# EasyEDA Pro project 轮腿PCB.eprj, board PCB2
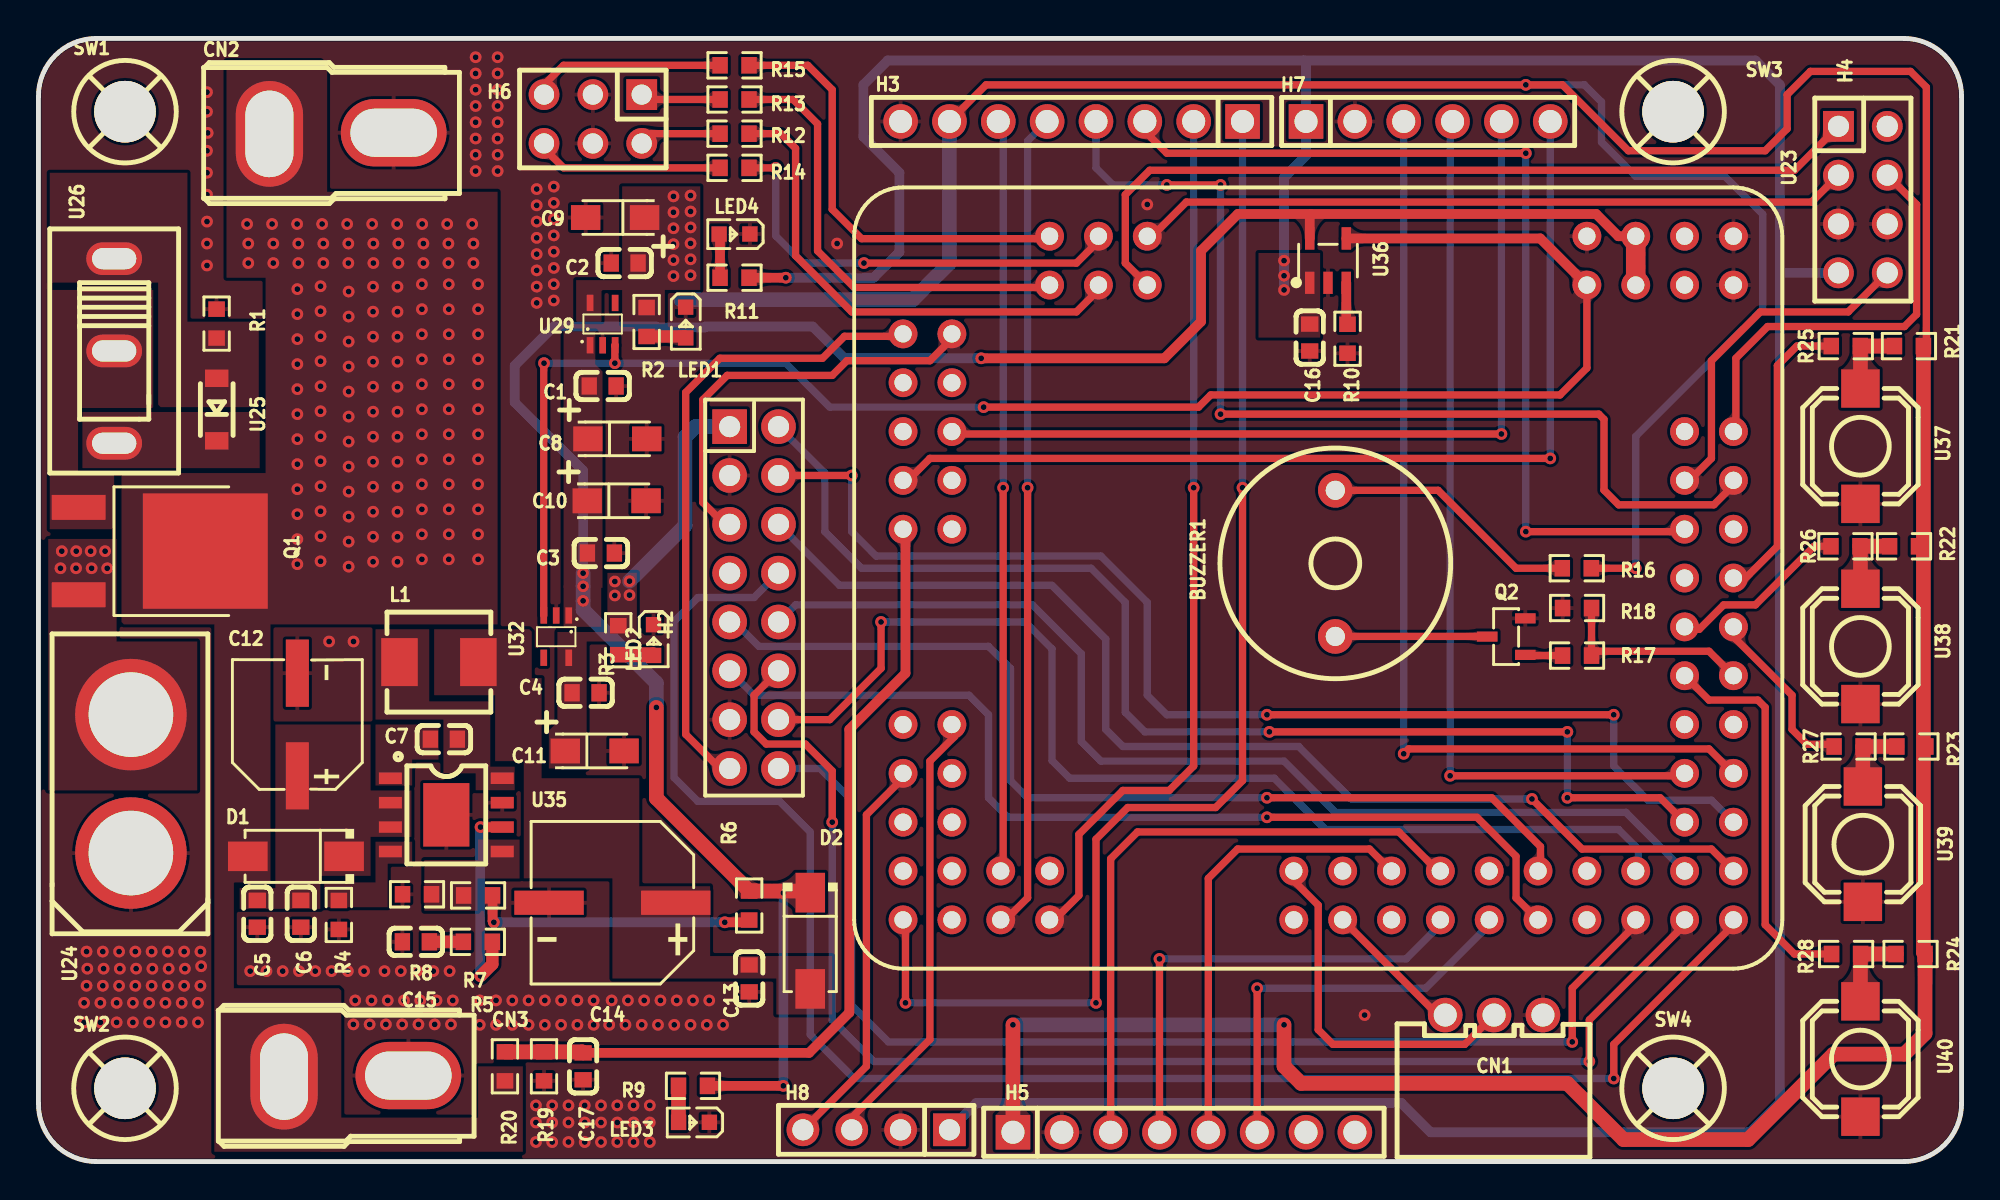
[diagram p8: board, top side]
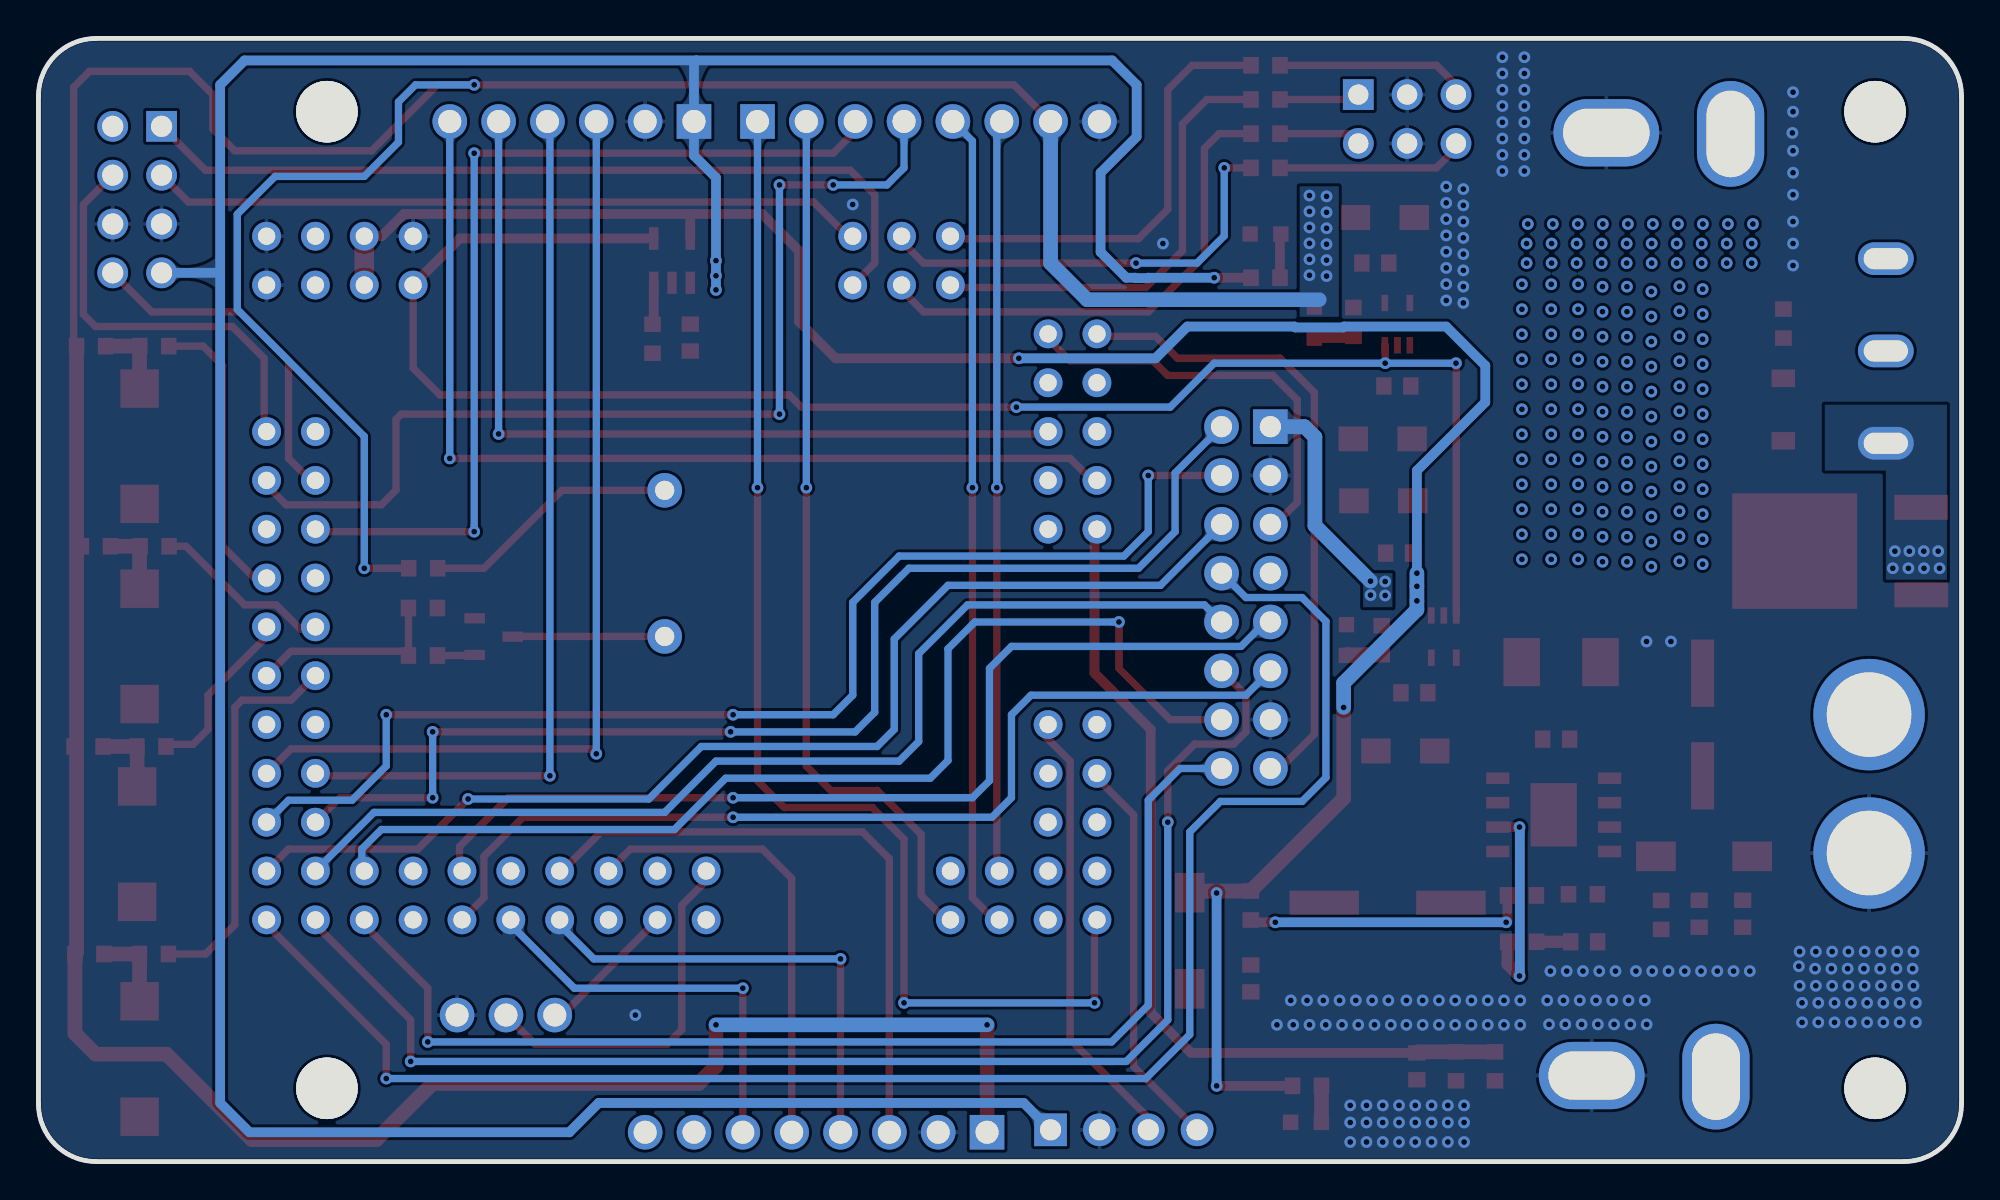
[diagram p9: board, bottom side, seen from below]

Outline 100 x 58.42 mm; copper layers: Top Layer, Bottom Layer. Coordinates in mm from the lower left corner of the outline.
Outline path: 0,55.42 0,3 arc(0.88,0.88) 3,0 97,0 arc(99.12,0.88) 100,3 100,55.42 arc(99.12,57.54) 97,58.42 3,58.42 arc(0.88,57.54) 0,55.42
Stack: Top Layer 0.035mm / Dielectric1 1.51mm FR4 er 4.5 / Bottom Layer 0.035mm

## Design rules (mm)
template: JLCPCB Capability(Two Layers Board)
spacing copperThickness1oz (default): track to track 0.102, other pairs 0.152 to 0.3
spacing copperThickness2oz: track to track 0.203, other pairs 0.152 to 0.3
track width copperThickness1oz (default): min 0.127, default 0.254, max 2.54
track width copperThickness2oz: min 0.203, default 0.254, max 2.54
differential pair differentialPair (default): width min 0.127, default 0.254, max 2.54; gap min 0.152, default 0.152
via viaSize (default): diameter min 0.5, default 0.61, max 10; hole min 0.3, default 0.305, max 6.3

## Placement (name value [footprint] x y rotation side)
BUZZER1  2.4kHz  [BUZ-TH_BD12.0-P7.60-D0.6-FD]  67.44 31.11 270 top
C1  100nF  [C0603]  29.34 40.34 180 top
C2  100nF  [C0603]  30.48 46.74 0 top
C3  100nF  [C0603]  29.25 31.65 180 top
C4  100nF  [C0603]  28.45 24.38 180 top
C5  4.7uf  [C0603]  11.38 12.89 90 top
C6  100nF  [C0603]  13.64 12.89 90 top
C7  100nF  [C0603]  21.08 21.97 0 top
C8  10uF  [CAP-SMD_L3.2-W1.6-RD-C7171]  30.1 37.59 0 top
C9  10uF  [CAP-SMD_L3.2-W1.6-RD-C7171]  29.99 49.1 180 top
C10  10uF  [CAP-SMD_L3.2-W1.6-RD-C7171]  30.06 34.37 0 top
C11  10uF  [CAP-SMD_L3.2-W1.6-RD-C7171]  28.92 21.36 0 top
C12  100uF  [CAP-SMD_BD6.3-L6.6-W6.6-LS7.3-FD-H7.7]  13.46 22.73 90 top
C13  47uf  [C0603]  36.96 9.52 90 top
C14  220uF  [CAP-SMD_BD8.0-L8.3-W8.3-LS9.1-FD]  29.84 13.46 180 top
C15  4.7nF  [C0603]  19.62 11.43 0 top
C16  100nF  [C0603]  66.1 42.86 90 top
C17  100nF  [C0603]  28.32 4.95 90 top
CN1  XH-3AW  [CONN-TH_3P-P2.54_HCTL_XH-3AW]  75.69 7.62 180 top
CN2  AM-1015B-M  [CONN-TH_AM-1015B-M]  15.24 53.49 0 top
CN3  AM-1015B-M  [CONN-TH_AM-1015B-M]  16 4.44 0 top
D1  SS54  [SMA_L4.4-W2.8-LS5.4-R-RD]  13.39 15.87 180 top
D2  SS54  [SMA_L4.4-W2.8-LS5.4-R-RD]  40.13 11.48 270 top
H2  -  [HDR-TH_16P-P2.54-V-F-R2-C8-S2.54-1]  37.21 29.34 270 top
H3  -  [HDR-TH_8P-P2.54-V-F-1]  53.72 54.1 180 top
H4  -  [HDR-TH_8P-P2.54-V-F-R2-C4-S2.54-1]  94.87 50.04 270 top
H5  -  [HDR-TH_8P-P2.54-V-F-1]  59.56 1.52 0 top
H6  -  [HDR-TH_6P-P2.54-V-R2-C3-S2.54_A2541WV-2X3P]  28.83 54.23 180 top
H7  -  [HDR-TH_6P-P2.54-V-M-1]  72.26 54.1 0 top
H8  -  [HDR-TH_4P-P2.54-V-M]  43.56 1.65 180 top
L1  4.7uH  [IND-SMD_L5.4-W5.2_FXL0530]  20.82 25.98 0 top
LED1  -  [LED_0603]  33.66 43.59 270 top
LED2  -  [LED_0603]  31.99 27.08 270 top
LED3  -  [LED_0603]  34.04 2.03 180 top
LED4  -  [LED_0603]  36.14 48.24 180 top
Q1  HY19P03D  [TO-252-2_L6.6-W6.1-P4.57-LS9.9-TL-CW]  5.38 31.76 0 top
Q2  S8050  [SOT-23-3_L2.9-W1.3-P1.90-LS2.3-BR]  76.33 27.3 0 top
R1  10K  [R0603]  9.26 43.59 270 top
R2  2.7K  [R0603]  31.62 43.67 270 top
R3  2.7K  [R0603]  30.15 27.12 270 top
R4  200K  [R0603]  15.62 12.83 90 top
R5  20K  [R0603]  22.85 11.43 0 top
R6  51K  [R0603]  36.96 13.32 90 top
R7  1.5K  [R0603]  22.86 13.84 0 top
R8  10K  [R0603]  19.69 13.9 0 top
R9  4.7K  [R0603]  34.04 3.94 0 top
R10  4.7K  [R0603]  68.07 42.8 90 top
R11  4.7K  [R0603]  36.19 45.97 0 top
R12  100R  [R0603]  36.19 53.47 180 top
R13  100R  [R0603]  36.19 55.24 180 top
R14  100R  [R0603]  36.19 51.69 0 top
R15  100R  [R0603]  36.19 57.02 0 top
R16  10R  [R0603]  79.99 30.86 180 top
R17  4.7K  [R0603]  80.01 26.32 180 top
R18  1K  [R0603]  80.01 28.79 180 top
R19  20K  [R0603]  26.29 4.95 90 top
R20  200K  [R0603]  24.26 4.95 270 top
R21  4.7K  [R0603]  97.26 42.42 180 top
R22  4.7K  [R0603]  97.01 32 180 top
R23  4.7K  [R0603]  97.39 21.59 180 top
R24  4.7K  [R0603]  97.35 10.79 180 top
R25  470R  [R0603]  93.98 42.42 180 top
R26  470R  [R0603]  93.96 32 180 top
R27  470R  [R0603]  94.12 21.59 180 top
R28  470R  [R0603]  94 10.79 180 top
SW1  -  [M3螺丝]  4.5 54.61 0 top
SW2  -  [M3螺丝]  4.5 3.81 0 top
SW3  -  [M3螺丝]  85 54.61 0 top
SW4  -  [M3螺丝]  85 3.81 0 top
U23  CYT4BB7CEx_CoreBoard  [CYT4BB7CEx_CoreBoard_V1.x]  62.74 30.35 270 top
U24  XT60-M.  [CONN-TH_XT60]  4.81 19.65 90 top
U25  BZT52C16-E3-08  [SOD-123_L2.7-W1.6-LS3.7-R-RD]  9.27 39.12 90 top
U26  HX SS12D10G4  [SW-TH_SHOU-HAN_SS12D10G4]  3.94 42.16 270 top
U29  RT9013-33GU5  [SC-70-5_L2.0-W1.3-P0.65-LS2.1-BR]  29.34 43.56 270 top
U32  RT9013-33GU5  [SC-70-5_L2.0-W1.3-P0.65-LS2.1-BR]  26.92 27.3 90 top
U35  SCT2450CQSTER  [ESOP-8_L4.9-W3.9-P1.27-LS6.0-BL-EP]  21.21 18.03 270 top
U36  SY6280AAC  [SOT-23-5_L3.0-W1.7-P0.95-LS2.8-BL]  67.06 46.86 0 top
U37  TS6643WS 250gf 072  [SW-SMD_L6.0-W6.0-P6.00-LS6.8]  94.74 37.21 270 top
U38  TS6643WS 250gf 072  [SW-SMD_L6.0-W6.0-P6.00-LS6.8]  94.74 26.8 270 top
U39  TS6643WS 250gf 072  [SW-SMD_L6.0-W6.0-P6.00-LS6.8]  94.87 16.51 270 top
U40  TS6643WS 250gf 072  [SW-SMD_L6.0-W6.0-P6.00-LS6.8]  94.74 5.33 270 top

## Footprints (pads in the part's own frame, mm; a bottom-side part is the same pattern mirrored in y, then rotated)
BUZ-TH_BD12.0-P7.60-D0.6-FD
  round 1.8 hole 1: 1(-3.8,0) 2(3.8,0)
C0603
  rect 0.8x0.9 smd: 1(-0.7,0) 2(0.7,0)
CAP-SMD_BD6.3-L6.6-W6.6-LS7.3-FD-H7.7
  rect 3.5x1.2 smd: 1(-2.67,0) 2(2.67,0)
CAP-SMD_BD8.0-L8.3-W8.3-LS9.1-FD
  rect 3.61x1.26 smd: 1(-3.295,0) 2(3.295,0)
CAP-SMD_L3.2-W1.6-RD-C7171
  rect 1.53x1.296 smd: 1(-1.53,0) 2(1.53,0)
CONN-TH_3P-P2.54_HCTL_XH-3AW
  round 1.8 hole 1.199: 1(-2.54,0) 2(0.002,0) 3(2.54,0)
CONN-TH_AM-1015B-M
  oval 3.5x5.5 hole 2.5x4.5: 1(-3.231,-0.029)
  oval 5.5x3.5 hole 4.5x2.5: 2(3.231,0.029)
CONN-TH_XT60
  round 5.8 hole 4.4: 1(-3.6,0) 2(3.6,0)
CYT4BB7CEx_CoreBoard_V1.x
  round 1.5 hole 0.9: 1(-17.78,25.4) 2(-15.24,25.4) 3(-17.78,22.86) 4(-15.24,22.86) 5(-17.78,20.32) 6(-15.24,20.32) 7(-17.78,17.78) 8(-15.24,17.78) 25(-17.78,-5.08) 26(-15.24,-5.08) 27(-17.78,-7.62) 28(-15.24,-7.62) 29(-17.78,-10.16) 30(-15.24,-10.16) 37(-12.7,-17.78) 38(-12.7,-15.24) 39(-10.16,-17.78) 40(-10.16,-15.24) 41(-7.62,-17.78) 42(-7.62,-15.24) 43(-5.08,-17.78) 44(-5.08,-15.24) 45(-2.54,-17.78) 46(-2.54,-15.24) 53(7.62,-17.78) 54(7.62,-15.24) 55(10.16,-17.78) 56(10.16,-15.24) 57(12.7,-17.78) 58(12.7,-15.24) 59(17.78,-17.78) 60(15.24,-17.78) 61(17.78,-15.24) 62(15.24,-15.24) 63(17.78,-12.7) 64(15.24,-12.7) 65(17.78,-10.16) 66(15.24,-10.16) 75(17.78,2.54) 76(15.24,2.54) 77(17.78,5.08) 78(15.24,5.08) 79(17.78,7.62) 80(15.24,7.62) 81(17.78,10.16) 82(15.24,10.16) 83(17.78,12.7) 84(15.24,12.7) 85(17.78,15.24) 86(15.24,15.24) 87(17.78,17.78) 88(15.24,17.78) 89(17.78,20.32) 90(15.24,20.32) 91(17.78,22.86) 92(15.24,22.86) 93(17.78,25.4) 94(15.24,25.4) 95(12.7,25.4) 96(12.7,22.86) 97(10.16,25.4) 98(10.16,22.86) 99(7.62,25.4) 100(7.62,22.86) 101(5.08,25.4) 102(5.08,22.86) 103(2.54,25.4) 104(2.54,22.86) 105(0,25.4) 106(0,22.86) 107(-2.54,25.4) 108(-2.54,22.86) 109(-5.08,25.4) 110(-5.08,22.86) 111(-7.62,25.4) 112(-7.62,22.86)
ESOP-8_L4.9-W3.9-P1.27-LS6.0-BL-EP
  rect 0.6x1.2 smd: 1(-1.905,-2.909) 2(-0.635,-2.909) 3(0.635,-2.909) 4(1.905,-2.909) 5(1.905,2.909) 6(0.635,2.909) 7(-0.635,2.909) 8(-1.905,2.909)
  rect 3.3x2.4 smd: 9(0,0)
HDR-TH_4P-P2.54-V-M
  rect 1.7x1.7 hole 1.1: 1(-3.81,0)
  round 1.7 hole 1.1: 2(-1.27,0) 3(1.27,0) 4(3.81,0)
HDR-TH_6P-P2.54-V-M-1
  rect 1.8x1.8 hole 1.2: 1(-6.35,0)
  round 1.8 hole 1.2: 2(-3.81,0) 3(-1.27,0) 4(1.27,0) 5(3.81,0) 6(6.35,0)
HDR-TH_6P-P2.54-V-R2-C3-S2.54_A2541WV-2X3P
  rect 1.6x1.6 hole 1.05: 1(-2.54,-1.27)
  round 1.6 hole 1.05: 2(-2.54,1.27) 3(0,-1.27) 4(0,1.27) 5(2.54,-1.27) 6(2.54,1.27)
HDR-TH_8P-P2.54-V-F-1
  rect 1.8x1.8 hole 1.2: 1(-8.89,0)
  round 1.8 hole 1.2: 2(-6.35,0) 3(-3.81,0) 4(-1.27,0) 5(1.27,0) 6(3.81,0) 7(6.35,0) 8(8.89,0)
HDR-TH_8P-P2.54-V-F-R2-C4-S2.54-1
  rect 1.6x1.6 hole 1.1: 1(-3.81,-1.27)
  round 1.6 hole 1.1: 2(-3.81,1.27) 3(-1.27,-1.27) 4(-1.27,1.27) 5(1.27,-1.27) 6(1.27,1.27) 7(3.81,-1.27) 8(3.81,1.27)
HDR-TH_16P-P2.54-V-F-R2-C8-S2.54-1
  rect 1.8x1.8 hole 1.1: 1(-8.89,-1.27)
  round 1.8 hole 1.1: 2(-8.89,1.27) 3(-6.35,-1.27) 4(-6.35,1.27) 5(-3.81,-1.27) 6(-3.81,1.27) 7(-1.27,-1.27) 8(-1.27,1.27) 9(1.27,-1.27) 10(1.27,1.27) 11(3.81,-1.27) 12(3.81,1.27) 13(6.35,-1.27) 14(6.35,1.27) 15(8.89,-1.27) 16(8.89,1.27)
IND-SMD_L5.4-W5.2_FXL0530
  rect 1.9x2.5 smd: 1(-2.05,0) 2(2.05,0)
LED_0603
  rect 0.8x0.8 smd: 1(-0.851,-0.01) 2(0.75,-0.005)
M3螺丝
  round 3.2 hole 3.2: 1(0,0)
R0603
  rect 0.806x0.864 smd: 1(-0.753,0) 2(0.753,0)
SC-70-5_L2.0-W1.3-P0.65-LS2.1-BR
  rect 0.85x0.35 smd: 1(1.1,-0.65) 2(1.1,0) 3(1.1,0.65) 4(-1.1,0.65) 5(-1.1,-0.65)
SMA_L4.4-W2.8-LS5.4-R-RD
  rect 2.062x1.539 smd: 1(2.503,0) 2(-2.503,0)
SOD-123_L2.7-W1.6-LS3.7-R-RD
  rect 0.909x1.219 smd: 1(1.625,0) 2(-1.625,0)
SOT-23-3_L2.9-W1.3-P1.90-LS2.3-BR
  rect 1.07x0.532 smd: 1(0.99,-0.95) 2(0.99,0.95) 3(-0.99,0)
SOT-23-5_L3.0-W1.7-P0.95-LS2.8-BL
  rect 0.49x1.157 smd: 1(-0.95,-1.153) 2(0,-1.153) 3(0.95,-1.153)
  rect 0.49x1.175 smd: 4(0.95,1.153) 5(-0.95,1.153)
SW-SMD_L6.0-W6.0-P6.00-LS6.8
  rect 2x2 smd: 1(-3,0) 2(3,0)
SW-TH_SHOU-HAN_SS12D10G4
  oval 1.7x2.9 hole 1.1x2.3: 1(-4.8,0) 2(0,0) 3(4.8,0)
TO-252-2_L6.6-W6.1-P4.57-LS9.9-TL-CW
  rect 2.8x1.3 smd: 1(-3.292,2.273) 3(-3.292,-2.273)
  rect 6.5x6 smd: 2(3.292,0)

## Nets
As in the schematic.

Pads without a net: H2 7; H4 2; H5 7 8; SW1 1; SW2 1; SW3 1; SW4 1; U23 3 4 39 40 41 44 46 53 56 57 58 60 61 62 66 75 78 79 84 87 88 99 100 106 107 112; U29 4; U32 4

## Via types
v1: diameter 0.61, hole 0.305, Top Layer to Bottom Layer, 373 vias

## Routing (per net, layer and track width the routed paths; a pad name or vN(x,y) marks a point on that pad's centre or on a via; arc(x,y) is an arc through that point)
GND:
  vias: v1(2.37,8.25) v1(2.37,7.24) v1(2.5,10.92) v1(2.54,10.03) v1(2.5,9.14) v1(3.22,8.25) v1(3.22,7.24) v1(3.35,10.92) v1(3.35,9.14) v1(3.39,10.03) v1(4.06,8.25) v1(4.06,7.24) v1(4.19,10.92) v1(4.23,10.03) v1(4.19,9.14) v1(4.91,8.25) v1(4.91,7.24) v1(5.04,10.92) v1(5.04,9.14) v1(5.08,10.03) v1(5.76,8.25) v1(5.76,7.24) v1(5.88,10.92) v1(5.92,10.03) v1(5.88,9.14) v1(6.6,8.25) v1(6.6,7.24) v1(6.73,10.92) v1(6.73,9.14) v1(6.77,10.03) v1(7.45,8.25) v1(7.45,7.24) v1(7.58,10.92) v1(7.62,10.03) v1(7.58,9.14) v1(8.29,8.25) v1(8.29,7.24) v1(8.42,10.92) v1(8.42,9.14) v1(8.46,10.16) v1(8.76,55.63) v1(8.76,54.61) v1(8.8,53.51) v1(8.76,52.58) v1(8.76,51.43) v1(8.76,50.29) v1(8.76,48.89) v1(8.76,47.75) v1(8.76,46.61) v1(11.01,9.91) v1(11.86,9.91) v1(12.7,9.91) v1(13.55,9.91) v1(14.39,9.91) v1(15.11,27.05) v1(15.24,9.91) v1(16.08,9.91) v1(16.38,27.05) v1(16.38,7.13) v1(16.47,8.38) v1(16.93,9.91) v1(17.22,7.13) v1(17.32,8.38) v1(17.99,9.91) v1(18.07,7.13) v1(18.16,8.38) v1(18.84,9.91) v1(18.91,7.13) v1(19.01,8.38) v1(19.69,9.91) v1(19.76,7.13) v1(19.85,8.38) v1(20.53,9.91) v1(20.6,7.13) v1(20.7,8.38) v1(21.38,9.91) v1(21.55,8.38) v1(21.45,7.13) v1(22.73,57.44) v1(22.73,56.6) v1(22.73,55.75) v1(22.73,54.91) v1(22.73,54.06) v1(22.73,53.21) v1(22.73,52.37) v1(22.73,51.52) v1(22.95,8.38) v1(22.95,7.11) v1(23.79,8.38) v1(23.79,7.11) v1(23.88,57.44) v1(23.88,56.6) v1(23.88,55.75) v1(23.88,54.91) v1(23.88,54.06) v1(23.88,53.21) v1(23.88,52.37) v1(23.88,51.52) v1(24.64,8.38) v1(24.64,7.11) v1(25.48,8.38) v1(25.48,7.11) v1(25.91,50.59) v1(25.91,49.74) v1(25.91,48.89) v1(25.91,48.05) v1(25.91,47.2) v1(25.91,46.36) v1(25.91,45.51) v1(25.91,44.66) v1(25.87,2.92) v1(25.87,2.03) v1(25.87,1.02) v1(26.33,8.38) v1(26.33,7.11) v1(26.71,2.92) v1(26.71,2.03) v1(26.71,1.02) v1(26.8,50.71) v1(26.8,49.87) v1(26.8,49.02) v1(26.8,48.17) v1(26.8,47.33) v1(26.8,46.48) v1(26.8,45.64) v1(26.8,44.79) v1(27.18,8.38) v1(27.18,7.11) v1(27.56,2.92) v1(27.56,2.03) v1(27.56,1.02) v1(28.02,8.38) v1(28.02,7.11) v1(28.41,2.92) v1(28.41,2.03) v1(28.41,1.02) v1(28.87,8.38) v1(28.87,7.11) v1(29.25,2.92) v1(29.25,2.03) v1(29.25,1.02) v1(29.68,7.11) v1(29.81,8.38) v1(30.1,2.92) v1(30.1,2.03) v1(30.1,1.02) v1(30.52,7.11) v1(30.65,8.38) v1(30.94,2.92) v1(30.94,2.03) v1(30.94,1.02) v1(31.37,7.11) v1(31.5,8.38) v1(31.79,2.92) v1(31.79,2.03) v1(31.79,1.02) v1(32.22,7.11) v1(32.34,8.38) v1(33.06,7.11) v1(33.19,8.38) v1(33.91,7.11) v1(34.03,8.38) v1(34.75,7.11) v1(34.88,8.38) v1(35.6,7.11) v1(41.53,47.75) v1(57.66,49.78) v1(68.96,7.62)
VCC3V3: length 226.4
  Top Layer w0.381: R21.1 98.17,42.57 98.17,55.88 97.35,56.71 92.14,56.71 90.93,55.5 90.93,53.72 89.79,52.58 82.68,52.58 79.25,56.01 v1(77.34,56.01) 49.28,56.01 H3.7 ; R16.1 v1(83.06,30.86)
  Top Layer w0.762: v1(64.77,7.11) 64.77,4.95 65.66,4.06 79.5,4.06 82.42,1.14 88.9,1.14 93.34,5.59 97.03,5.59 98.1,6.66 R24.1 98.02,10.88 R21.1 ; H5.1 v1(50.67,7.11)
  Bottom Layer w0.381: v1(77.34,56.01) 80.39,56.01 81.28,55.12 81.28,53.02 83.06,51.24 87.69,51.24 89.66,49.28 89.66,44.32 83.06,37.72 v1(83.06,30.86)
  Bottom Layer w0.762: v1(50.67,7.11) v1(64.77,7.11) ; 33.4,44.83 45.47,44.83 47.37,46.74 H3.7
  vias: v1(33.02,50.21) v1(33.02,49.38) v1(33.02,48.55) v1(33.02,47.72) v1(33.02,46.89) v1(33.02,46.06) v1(33.91,50.25) v1(33.91,49.42) v1(33.91,48.59) v1(33.91,47.76) v1(33.91,46.93) v1(33.91,46.1)
VCC5V: length 119
  Top Layer w0.508: 83.06,48.13 82.15,48.13 81,49.29 66.17,49.29 ; v1(49.02,41.78) 58.55,41.78 60.45,43.69 60.45,47.37 62.37,49.29 66.17,49.29 ; 66.17,49.29 66.11,49.23 U36.5 ; R9.2 v1(38.74,3.94)
  Top Layer w0.762: D2.2 40.05,14.07 R6.2 32.13,18.9 v1(32.13,23.62)
  Top Layer w1.016: U23.6 83.06,48.13
  Bottom Layer w0.508: v1(38.74,3.94) v1(38.74,13.97) ; v1(49.02,41.78) 41.91,41.78 40.26,43.43 34.69,43.43 34.65,43.39 32.16,43.39 32.11,43.43 26.8,43.43 24.77,41.4 24.77,39.5 28.32,35.94 v1(28.32,30.61)
  Bottom Layer w0.762: v1(32.13,23.62) 32.13,24.89 28.32,28.7 v1(28.32,29.17) v1(28.32,29.92) v1(28.32,30.61)
VCC5V_EXT: length 180.1
  Top Layer w0.508: R11.2 v1(38.86,45.97)
  Bottom Layer w0.508: H8.1 48.77,3.05 70.87,3.05 72.39,1.52 89.03,1.52 90.55,3.05 90.55,46.23 ; 65.79,57.28 89.28,57.28 90.55,56.01 90.55,46.23 ; 65.79,57.28 65.91,57.15 H7.1 65.91,52.32 64.77,51.18 v1(64.77,46.86) v1(64.77,46.07) v1(64.77,45.34) ; 65.79,57.28 44.16,57.28 42.89,56.01 42.89,53.31 44.77,51.43 44.77,47.31 43.43,45.97 42.97,45.97 42.95,45.95 42.32,45.95 42.3,45.97 v1(38.86,45.97) ; 90.55,46.23 H4.7
VCCBAT:
  vias: v1(10.85,48.77) v1(10.91,47.75) v1(10.91,46.74) v1(12.15,48.77) v1(12.21,47.75) v1(12.21,46.74) v1(13.45,48.77) v1(13.51,47.75) v1(13.51,46.74) v1(13.46,45.38) v1(13.46,44.08) v1(13.46,42.78) v1(13.46,41.48) v1(13.46,40.18) v1(13.46,38.88) v1(13.46,37.58) v1(13.46,36.28) v1(13.46,34.97) v1(13.46,33.67) v1(13.46,32.37) v1(13.46,31.07) v1(14.67,45.53) v1(14.67,44.23) v1(14.67,42.93) v1(14.67,41.63) v1(14.67,40.33) v1(14.67,39.03) v1(14.67,37.73) v1(14.67,36.43) v1(14.67,35.13) v1(14.67,33.82) v1(14.67,32.52) v1(14.67,31.22) v1(14.75,48.77) v1(14.81,47.75) v1(14.81,46.74) v1(16.05,48.77) v1(16.11,47.75) v1(16.11,46.74) v1(16.13,45.25) v1(16.13,43.95) v1(16.13,42.65) v1(16.13,41.35) v1(16.13,40.05) v1(16.13,38.75) v1(16.13,37.45) v1(16.13,36.15) v1(16.13,34.85) v1(16.13,33.55) v1(16.13,32.25) v1(16.13,30.95) v1(17.35,48.77) v1(17.41,47.75) v1(17.41,46.74) v1(17.4,45.51) v1(17.4,44.21) v1(17.4,42.91) v1(17.4,41.61) v1(17.4,40.3) v1(17.4,39) v1(17.4,37.7) v1(17.4,36.4) v1(17.4,35.1) v1(17.4,33.8) v1(17.4,32.5) v1(17.4,31.2) v1(18.65,48.77) v1(18.72,47.75) v1(18.72,46.74) v1(18.67,45.51) v1(18.67,44.21) v1(18.67,42.91) v1(18.67,41.61) v1(18.67,40.3) v1(18.67,39) v1(18.67,37.7) v1(18.67,36.4) v1(18.67,35.1) v1(18.67,33.8) v1(18.67,32.5) v1(18.67,31.2) v1(19.94,45.63) v1(19.94,44.33) v1(19.94,43.03) v1(19.94,41.73) v1(19.94,40.43) v1(19.94,39.13) v1(19.94,37.83) v1(19.94,36.53) v1(19.94,35.23) v1(19.94,33.93) v1(19.94,32.63) v1(19.94,31.33) v1(19.95,48.77) v1(20.02,47.75) v1(20.02,46.74) v1(21.25,48.77) v1(21.32,47.75) v1(21.32,46.74) v1(21.34,45.63) v1(21.34,44.33) v1(21.34,43.03) v1(21.34,41.73) v1(21.34,40.43) v1(21.34,39.13) v1(21.34,37.83) v1(21.34,36.53) v1(21.34,35.23) v1(21.34,33.93) v1(21.34,32.63) v1(21.34,31.33) v1(22.55,48.77) v1(22.62,47.75) v1(22.62,46.74) v1(22.86,45.63) v1(22.86,44.33) v1(22.86,43.03) v1(22.86,41.73) v1(22.86,40.43) v1(22.86,39.13) v1(22.86,37.83) v1(22.86,36.53) v1(22.86,35.23) v1(22.86,33.93) v1(22.86,32.63) v1(22.86,31.33)
VCCCAM: length 11.2
  Bottom Layer w0.762: H2.1 34.16,38.23 33.62,37.69 33.62,33.08 v1(30.73,30.19)
  vias: v1(29.97,30.17) v1(29.97,29.45) v1(30.73,29.46)
4.0: length 37.2
  Top Layer w0.381: 57.78,48.01 59.69,49.91 92.2,49.91 H4.3
4.1: length 43.9
  Top Layer w0.381: 57.78,45.47 56.51,46.74 56.51,50.29 57.78,51.56 91.31,51.56 H4.1
5.0: length 22.9
  Top Layer w0.381: v1(42.93,46.74) 53.97,46.74 55.25,48.01 ; v1(38.34,51.69) R14.2
  Bottom Layer w0.381: v1(42.93,46.74) 39.75,46.74 38.34,48.15 v1(38.34,51.69)
5.1: length 25.9
  Top Layer w0.381: 55.25,45.47 53.97,44.2 42.29,44.2 39.37,47.12 39.37,52.7 38.61,53.47 R12.1
5.2: length 23.1
  Top Layer w0.381: 52.71,48.01 42.8,48.01 41.28,49.53 41.28,55.75 40,57.02 R15.2
5.3: length 23.7
  Top Layer w0.381: 52.71,45.47 42.42,45.47 40.51,47.37 40.51,53.97 39.24,55.24 R13.1
6.5: length 33.4
  Top Layer w0.381: 45.09,42.93 41.91,42.93 40.77,41.78 35.43,41.78 33.66,40 33.66,22.22 35.43,20.45 H2.15
6.6: length 21.7
  Top Layer w0.381: H2.5 35.69,33.15 34.54,34.29 34.54,39.62 35.81,40.89 41.28,40.89 42.04,41.66 46.35,41.66 47.62,42.93
7.2: length 44.7
  Top Layer w0.381: v1(76.07,37.85) 47.62,37.85
  Bottom Layer w0.381: H7.5 v1(76.07,37.85)
7.3: length 51.7
  Top Layer w0.381: v1(78.61,36.58) 46.35,36.58 45.09,35.31
  Bottom Layer w0.381: 78.87,54.1 78.61,53.85 v1(78.61,36.58)
7.5: length 45
  Top Layer w0.508: C17.2 40.07,5.65 42.16,7.75 42.16,22.48 45.09,25.4 45.09,32.77
  Top Layer w0.762: C17.2 28.27,5.71 R19.2 R20.1
10.0: length 23.2
  Top Layer w0.381: 47.62,22.61 47.62,22.1 46.35,20.83 46.35,6.35 42.29,2.29 H8.3
10.1: length 20.6
  Top Layer w0.381: H8.4 43.05,4.95 43.05,18.03 45.09,20.07
11.0: length 65.8
  Top Layer w0.381: 45.09,12.45 v1(45.09,8.25) ; v1(62.61,35.05) 62.61,19.81 61.21,18.41 56.64,18.41 54.99,16.76 v1(54.99,8.25)
  Bottom Layer w0.381: H3.1 v1(62.61,35.05) ; v1(54.99,8.25) v1(45.09,8.25)
12.1: length 42.6
  Top Layer w0.381: v1(51.44,35.05) 51.44,13.72 50.16,12.45
  Bottom Layer w0.381: H3.5 51.44,53.09 v1(51.44,35.05)
12.2: length 39.2
  Top Layer w0.381: 50.16,14.99 v1(50.16,35.05)
  Bottom Layer w0.381: H3.6 50.16,53.85 v1(50.16,35.05)
12.3: length 46.1
  Top Layer w0.381: v1(60.07,35.05) 60.07,20.57 58.8,19.3 56.39,19.3 54.1,17.02 54.1,13.84 52.71,12.45
  Bottom Layer w0.381: H3.2 v1(60.07,35.05)
14.0: length 18.7
  Top Layer w0.381: CN1.2 74.17,6.1 67.31,6.1 66.55,6.86 66.55,13.33 65.41,14.48 65.41,14.99
14.1: length 7.2
  Top Layer w0.381: 67.94,12.45 72.77,7.62 CN1.3
15.0: length 24
  Top Layer w0.381: 70.49,14.99 69.22,16.26 62.36,16.26 60.83,14.73 H5.5
15.1: length 24.5
  Top Layer w0.381: H5.4 v1(58.29,10.54)
  Bottom Layer w0.381: v1(58.29,10.54) 71.12,10.54 73.03,12.45
15.2: length 33
  Top Layer w0.381: H5.3 55.75,15.75 57.15,17.14 70.74,17.14 72.9,14.99 73.03,14.99
15.3: length 21.1
  Top Layer w0.381: v1(63.37,9.02) H5.6
  Bottom Layer w0.381: 75.56,12.45 72.14,9.02 v1(63.37,9.02)
17.1: length 51.4
  Top Layer w0.381: v1(63.88,17.91) 74.8,17.91 76.84,15.87 76.84,13.72 78.1,12.45
  Bottom Layer w0.381: H2.11 37.21,24.26 48.39,24.26 49.4,23.24 49.4,18.92 50.42,17.91 v1(63.88,17.91)
17.2: length 51.8
  Top Layer w0.381: v1(63.88,18.92) 75.56,18.92 78.1,16.38 78.1,14.99
  Bottom Layer w0.381: v1(63.88,18.92) 51.44,18.92 50.55,19.81 50.55,25.65 49.4,26.8 37.47,26.8 36.19,28.07 H2.9
18.0: length 61.1
  Top Layer w0.381: 83.19,12.45 79.76,9.02 v1(79.76,6.22)
  Bottom Layer w0.381: 38.48,20.45 40.64,20.45 42.29,18.8 42.29,8.13 44.2,6.22 v1(79.76,6.22)
18.1: length 57.8
  Top Layer w0.381: 38.48,22.99 41.15,22.99 43.81,25.65 v1(43.81,28.07)
  Bottom Layer w0.381: 83.19,14.99 83.19,16.26 82.17,17.27 66.93,17.27 64.26,19.94 53.62,19.94 52.71,20.86 52.71,26.67 51.31,28.07 v1(43.81,28.07)
18.2: length 71.2
  Top Layer w0.381: v1(80.65,5.21) 80.65,7.37 85.72,12.45 ; 38.48,25.53 37.21,24.26 37.21,22.35 37.85,21.72 39.88,21.72 41.28,20.32 v1(41.28,17.65)
  Bottom Layer w0.381: v1(41.28,17.65) 41.28,7.37 43.43,5.21 v1(80.65,5.21)
18.3: length 56.1
  Bottom Layer w0.381: 38.48,28.07 39.37,28.96 51.69,28.96 54.23,26.42 54.23,21.84 55.25,20.83 64.77,20.83 67.44,18.16 82.55,18.16 85.72,14.99
18.4: length 86.9
  Top Layer w0.381: v1(81.91,4.32) 81.91,6.1 88.26,12.45
  Bottom Layer w0.381: v1(81.91,4.32) 42.42,4.32 40.13,6.6 40.13,17.14 38.54,18.73 34.29,18.73 33.05,19.97 33.05,28.1 34.29,29.34 37.21,29.34 38.48,30.61
18.5: length 60.1
  Top Layer w0.381: v1(77.66,18.86) 80.26,16.26 87,16.26 88.26,14.99
  Bottom Layer w0.381: 38.48,33.15 41.66,29.97 52.71,29.97 55.5,27.18 55.5,22.48 56.39,21.59 65.53,21.59 68.26,18.86 v1(77.66,18.86)
18.6: length 63.4
  Top Layer w0.381: v1(81.91,23.24) v1(63.88,23.24) ; v1(42.29,35.69) 38.48,35.69
  Bottom Layer w0.381: v1(42.29,35.69) 42.29,32.77 43.56,31.5 55.25,31.5 57.66,29.08 57.66,24.26 58.67,23.24 v1(63.88,23.24) ; 88.26,17.53 87,18.8 83.69,18.8 81.91,20.57 v1(81.91,23.24)
18.7: length 63
  Top Layer w0.381: v1(79.5,22.35) v1(64.01,22.35) ; 85.72,17.53 84.33,18.92 v1(79.5,18.92)
  Bottom Layer w0.381: v1(64.01,22.35) 57.53,22.35 56.51,23.37 56.51,29.08 54.74,30.86 42.8,30.86 40.89,32.77 40.89,35.81 38.48,38.23 ; v1(79.5,18.92) v1(79.5,22.35)
19.0: length 50.8
  Top Layer w0.381: v1(70.99,21.21) 71.25,21.46 86.87,21.46 88.26,20.07
  Bottom Layer w0.381: v1(70.99,21.21) H7.3
19.1: length 46.4
  Top Layer w0.381: 85.72,20.07 v1(73.41,20.07)
  Bottom Layer w0.381: 73.53,54.1 73.41,53.97 v1(73.41,20.07)
19.4: length 10.6
  Top Layer w0.381: R18.1 R17.1 80.98,26.54 86.87,26.54 88.26,25.15
20.0: length 20.1
  Top Layer w0.381: R28.2 91.31,10.79 89.79,12.32 89.79,23.62 89.41,24 86.87,24 85.72,25.15
20.1: length 9
  Top Layer w0.381: R27.2 93.26,21.7 91.96,21.7 91.19,22.48 91.19,24.26 88.26,27.18 88.26,27.69
20.2: length 8.9
  Top Layer w0.381: 86.11,27.69 86.36,27.69 87.63,28.96 89.28,28.96 92.33,32 93.21,32
20.3: length 15.1
  Top Layer w0.381: R25.2 91.44,42.42 90.42,41.4 90.42,32 88.65,30.23
22.3: length 48.9
  Top Layer w0.381: v1(77.34,52.45) 58.67,52.45 57.53,53.59 H3.3 ; 85.72,32.77 v1(77.34,32.77)
  Bottom Layer w0.381: v1(77.34,32.77) v1(77.34,52.45)
22.4: length 52.6
  Top Layer w0.381: v1(61.47,38.88) 81.14,38.88 81.41,38.61 81.41,34.92 82.17,34.16 87.12,34.16 88.26,35.31 ; v1(61.47,50.8) v1(58.67,50.8)
  Bottom Layer w0.381: v1(58.67,50.8) 55.88,50.8 54.99,51.69 H3.4 ; v1(61.47,38.88) v1(61.47,50.8)
22.5: length 17.9
  Top Layer w0.381: H4.8 94.11,44.2 89.53,44.2 87,41.66 87,36.58 85.72,35.31
22.6: length 22.2
  Top Layer w0.381: H4.4 97.66,49.78 97.66,44.07 97.03,43.43 89.92,43.43 88.26,41.78 88.26,37.85
CR: length 87.9
  Top Layer w0.381: U32.3 26.27,41.51 v1(26.29,41.53) ; U23.8 80.52,41.27 79.12,39.88 60.96,39.88 60.32,39.24 v1(49.15,39.24) ; v1(29.97,41.53) 29.97,42.45 29.99,42.46
  Top Layer w0.508: U23.8 78.09,48.02 U36.4
  Bottom Layer w0.381: v1(26.29,41.53) v1(29.97,41.53) 38.86,41.53 41.15,39.24 v1(49.15,39.24)
$2N293:
  vias: v1(1.14,30.86) v1(1.21,31.75) v1(1.96,31.75) v1(1.95,30.86) v1(2.71,31.75) v1(2.76,30.86) v1(3.47,31.75) v1(3.58,30.86)
$2N1583: length 2.1
  Top Layer w0.635: LED1.2 33.58,42.92 31.62,42.92
$2N1949: length 1.9
  Top Layer w0.762: LED2.2 31.95,26.36 R3.2
$2N4209: length 1.8
  Top Layer w0.635: C15.2 R5.1
$2N4213: length 10.9
  Top Layer w0.508: U35.6 v1(22.99,17.4)
  Top Layer w0.635: R5.2 23.6,10.27 v1(22.99,9.65)
  Bottom Layer w0.508: v1(22.99,17.4) 22.97,17.38 22.97,9.67 v1(22.99,9.65)
$2N4321: length 14.8
  Top Layer w0.508: R6.1 36.84,12.45 v1(35.69,12.45) ; R7.2 23.61,12.51 v1(23.68,12.45)
  Bottom Layer w0.508: v1(35.69,12.45) v1(23.68,12.45)
$2N4596: length 1.9
  Top Layer w0.762: R9.1 33.28,2.04 LED3.2
$2N4969: length 2.2
  Top Layer w0.508: U36.3 68.01,43.62 R10.2
$2N5187: length 2.3
  Top Layer w0.508: 35.4,48.24 35.44,48.2 R11.1
$2N7606: length 4.3
  Top Layer w0.381: R12.2 31.88,53.47 H6.2
$2N7608: length 4.2
  Top Layer w0.381: R13.2 31.62,55.24 H6.1
$2N7610: length 10.1
  Top Layer w0.381: H6.5 26.29,56.01 27.31,57.02 R15.1
$2N7612: length 9.8
  Top Layer w0.381: H6.6 26.29,52.7 27.31,51.69 R14.1
$2N7802: length 13.5
  Top Layer w0.381: R16.2 76.84,30.86 72.78,34.91 67.44,34.91
$2N7975: length 2
  Top Layer w0.381: R17.2 77.27,26.32 77.27,26.35
$2N8022: length 7.9
  Top Layer w0.381: Q2.3 75.33,27.31 BUZZER1.2
$2N9225: length 4
  Top Layer w0.762: U37.1 94.74,42.41 R25.1 R21.2
$2N9229: length 3.8
  Top Layer w0.762: U38.1 94.74,31.98 R26.1 96.26,32
$2N9234: length 3.8
  Top Layer w0.762: R23.2 R27.1 94.87,21.58 U39.1
$2N9239: length 4.3
  Top Layer w0.762: U40.1 94.74,10.79 94.75,10.79 R24.2

## Copper pours and planes (outline as drawn; the poured copper is in the pictures)
GND on Top Layer: -14.61,68.45 108.46,68.45 108.46,-14.48 -14.61,-14.48
GND on Bottom Layer: -22.1,76.33 128.91,76.33 128.91,-20.57 -22.1,-20.57
VCC3V3 on Top Layer: 27.96,50.73 34.42,50.73 34.42,43.56 27.96,43.56
VCC3V3 on Bottom Layer: 32.38,50.73 34.42,50.73 34.42,43.94 32.38,43.94
VCC5V on Top Layer: 27.31,29.97 29.26,29.97 29.26,27.81 27.31,27.81
VCC5V on Top Layer: 27.31,43.18 29.33,43.18 29.33,29.84 27.31,29.84
VCC5V_EXT on Top Layer: 63.44,47.26 66.65,47.26 66.65,42.86 63.44,42.86
VCCBAT on Top Layer: 14.67,4.95 25.19,4.95 25.19,0.51 14.67,0.51
VCCBAT on Top Layer: 4.32,57.24 23.88,57.24 23.88,0.51 4.32,0.51
VCCCAM on Top Layer: 26.54,30.62 31.12,30.62 31.12,20.45 26.54,20.45
VCCCAM on Bottom Layer: 29.59,30.61 31.12,30.61 31.12,28.83 29.59,28.83
$2N234 on Top Layer: 0.59,51.43 11.45,51.43 11.45,39.24 0.59,39.24
$2N293 on Top Layer: 0.51,32.38 8.25,32.38 8.25,19.3 0.51,19.3
$2N293 on Top Layer: 2.29,38.99 11.5,38.99 11.5,36.07 2.29,36.07
$2N293 on Bottom Layer: 0.76,39.37 7.11,39.37 7.11,30.23 0.76,30.23
$2N569 on Top Layer: 0.58,45.34 5.97,45.34 5.97,32.89 0.58,32.89
$2N2132 on Top Layer: 10.46,22.73 19.39,22.73 19.39,13.14 10.46,13.14
$2N2387 on Top Layer: 14.86,16.64 19.43,16.64 19.43,13.23 14.86,13.23
$2N2461 on Top Layer: 17.53,22.73 20.8,22.73 20.8,19.56 17.53,19.56
$2N2539 on Top Layer: 17.53,27.69 24.77,27.69 24.77,19.31 17.53,19.31
$2N3928 on Top Layer: 20.57,27.69 41.28,27.69 41.28,7.65 20.57,7.65
$2N4347 on Top Layer: 20.07,16.75 25.02,16.75 25.02,13.04 20.07,13.04

Small or netless copper shapes (teardrops, artwork), in the pictures only: 178 on Top Layer, 80 on Bottom Layer
